# Altium schematic sheet clock.schdoc
size 292 x 204 mm; Device: A_A4; Symbol: A_A4; Name: A_A4; @Project Name: AdaCoreFPGA_2025-01-11_13-44-30; REV: 1.0; Date: 2024-10-25; Sheet: 1/1; Draw By: k3nn3dy; Company: Your Company; Convert to PCB: yes; Add into BOM: yes; @Page No: 5; @Page Count: 6; @Schematic Name: AdaCoreFPGA; @Board Name: AdaCoreFPGA; @Update Date: 2025-01-11; @Create Time: 13:44:40; @Update Time: 14:43:04; @Page Name: Clock_Generator; @Create Date: 2025-01-11
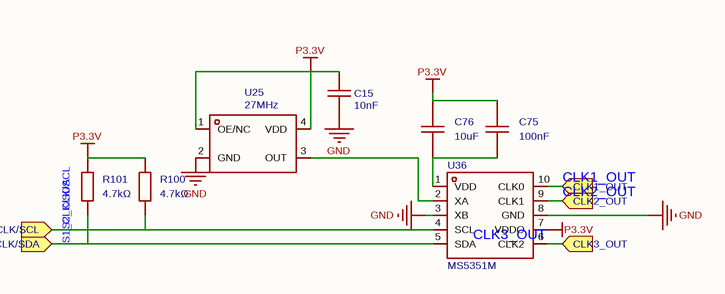
[diagram p0: clock.schdoc]

## Parts
C15  10nF  [C0603]
C75  100nF  [C0603]
C76  10uF  [C1210]
R100  4.7kΩ  [R0603]
R101  4.7kΩ  [R0603]
U25  27MHz  [CRYSTAL-SMD_4P-L2.5-W2.0-BL]
U36  MS5351M  [MSOP-10_L3.0-W3.0-P0.50-LS5.0-BL]

## Ports
CLK1_OUT (in), CLK2_OUT (in), CLK3_OUT (in), S1_CLK/SDA (in), S2_CLK/SCL (in)

## Nets
GND: C15.1 U25.2(GND) U36.3(XB) U36.8(GND)
P3.3V: C15.2 C75.2 C76.2 R100.2 R101.2 U25.1(OE/NC) U25.4(VDD) U36.7(VDDO)
CLK1_OUT: U36.10(CLK0) ; port CLK1_OUT
CLK2_OUT: U36.9(CLK1) ; port CLK2_OUT
CLK3_OUT: U36.6(CLK2) ; port CLK3_OUT
S1_CLK/SDA: R101.1 U36.5(SDA) ; port S1_CLK/SDA
S2_CLK/SCL: R100.1 U36.4(SCL) ; port S2_CLK/SCL
NetC75_1: C75.1 C76.1 U36.1(VDD)
NetU25_3: U25.3(OUT) U36.2(XA)

## Notes on the sheet
- 1
- 2
- 3
- 4
- 5
- A
- B
- C
- D
- TITLE:
- AdaCoreFPGA_2025-01-11_13-44-30
- Company:
- Your Company
- Sheet:
- REV:
- 1.0
- 1/1
- Date:
- 2024-10-25
- Drawn By:
- k3nn3dy

## Library data of the parts
C15 = 10nF: Manufacturer Part: CL10B103KB8NNNC; Manufacturer: SAMSUNG(三星); Convert to PCB: yes; Origin Footprint: C0603; Device: 10nF; Symbol: 10nF; Supplier: LCSC; Supplier Part: C1589; JLCPCB Part Class: Extended Part; Add into BOM: yes; FootprintName: C0603
C75 = C0603X104K050T: Capacitance: Tolerance:±10% Tolerance:±10% Voltage Rated: Temperature Coefficient:; Manufacturer: IHHEC(禾伸堂); AddInBom: yes; ModelId: 624118aa3cc7497086c383c2d72e0852; ModelName: C0603_L1.6-W0.8-H0.8; ModelTransform: 62.992,31.496,0,0,0,0,0,0,0; Tolerance: ±10%; Symbol: C0603X104K050T; Device: C0603X104K050T; LCSC Part Name: 100nF ±10% 50V; SupplierPart: C187860; ManufacturerPart: C0603X104K050T; Supplier Footprint: 0603; JLCPCB Part Class: Extended Part; Datasheet: https://atta.szlcsc.com/upload/public/pdf/source/20180316/B1A881EE882D7AA2911761F448C7BFE2.pdf; Supplier: LCSC; ConvertToPcb: yes; FootprintName: C0603; Value: 100nF
C76 = CS3225X7R106K500NRL: Capacitance: Voltage Rated: Temperature Coefficient:; Manufacturer: SAMWHA(三和); AddInBom: yes; ModelId: 9bc01558702f4bd6b0b47bb74017b6c5; ModelName: C1210_L3.2-W2.5-H2.5; ModelTransform: 125.984,98.425,0,0,0,0,0,0,0; Symbol: CS3225X7R106K500NRL; Device: CS3225X7R106K500NRL; LCSC Part Name: 10uF 50V; SupplierPart: C2918502; ManufacturerPart: CS3225X7R106K500NRL; Supplier Footprint: 1210; JLCPCB Part Class: Extended Part; Datasheet: https://atta.szlcsc.com/upload/public/pdf/source/20230815/D6EC8E8D4948B4151F2C89DF2FF24A45.pdf; Supplier: LCSC; ConvertToPcb: yes; FootprintName: C1210; Value: 10uF
R100 R101 = RC0603FR-074K7L: Type:Thick Film Resistors Resistance: Tolerance:±1% Tolerance:±1% Power(Watts): Overload Voltage (Max): Temperature Coefficient:±100ppm/℃ Temperature Coefficient:±100ppm/℃ Operating Temperature Range:-55℃~+155℃ Operating Temperature Range:-55℃~+155℃; Manufacturer: YAGEO(国巨); AddInBom: yes; ModelId: 112863783b5b41f1b5254f87eedc7932; ModelTransform: 31.8897,63.7794,0,90,0,0,0,0,0; Tolerance: ±1%; Symbol: RC0603FR-074K7L; Device: RC0603FR-074K7L; LCSC Part Name: 厚膜电阻 4.7kΩ ±1% 100mW; SupplierPart: C99782; ManufacturerPart: RC0603FR-074K7L; Supplier Footprint: 0603; JLCPCB Part Class: Extended Part; Datasheet: https://atta.szlcsc.com/upload/public/pdf/source/20180224/C181757_15194369480721363983.pdf; Supplier: LCSC; ConvertToPcb: yes; FootprintName: R0603; ModelName: R0603; Type: Thick Film Resistors; Value: 4.7kΩ; Temperature Coefficient: ±100ppm/℃; Operating Temperature Range: -55℃~+155℃
U25 = 27MHz: Manufacturer: SJK(晶科鑫); Manufacturer Part: 2NM27000C33YC; Convert to PCB: yes; Origin Footprint: CRYSTAL-SMD_4P-L2.5-W2.0-BL; Device: 27MHz; Symbol: 27MHz; Supplier: LCSC; Supplier Part: C668764; Add into BOM: yes; FootprintName: CRYSTAL-SMD_4P-L2.5-W2.0-BL
U36 = MS5351M: Interface:I2C Output Frequency (Max):200MHz Supply Voltage:2.7V~3.3V Supply Voltage:2.7V~3.3V Number of Outputs:3 Input Low Voltage:- Input Low Voltage:- Intput High Voltage:- Intput High Voltage:- Output Low Voltage:600mV Output Low Voltage:600mV Output; Manufacturer: 杭州瑞盟; AddInBom: yes; ModelId: 875cf331c88d40d1aea94374997f39b1; ModelName: MSOP-10_L3.0-W3.0-H1.1-LS5.0-P0.50; ModelTransform: 118.11,196.85,0,0,0,0,0,0,0; Interface: I2C; Output Frequency (Max): 200MHz; Number of Outputs: 3; Output Low Voltage: 600mV; Output High Voltage: 2.7V; Symbol: MS5351M; Device: MS5351M; LCSC Part Name: MS5351M; SupplierPart: C1509083; ManufacturerPart: MS5351M; Supplier Footprint: MSOP-10; JLCPCB Part Class: Extended Part; Datasheet: https://atta.szlcsc.com/upload/public/pdf/source/20240418/7555041AE934D685742A157FDD128132.pdf; Supplier: LCSC; ConvertToPcb: yes; FootprintName: MSOP-10_L3.0-W3.0-P0.50-LS5.0-BL; Supply Voltage: 2.7V~3.3V; Input Low Voltage: -; Intput High Voltage: -; Operating Temperatue: -55℃~+150℃